# EAGLE design voedingequ (EAGLE 9.1.2)
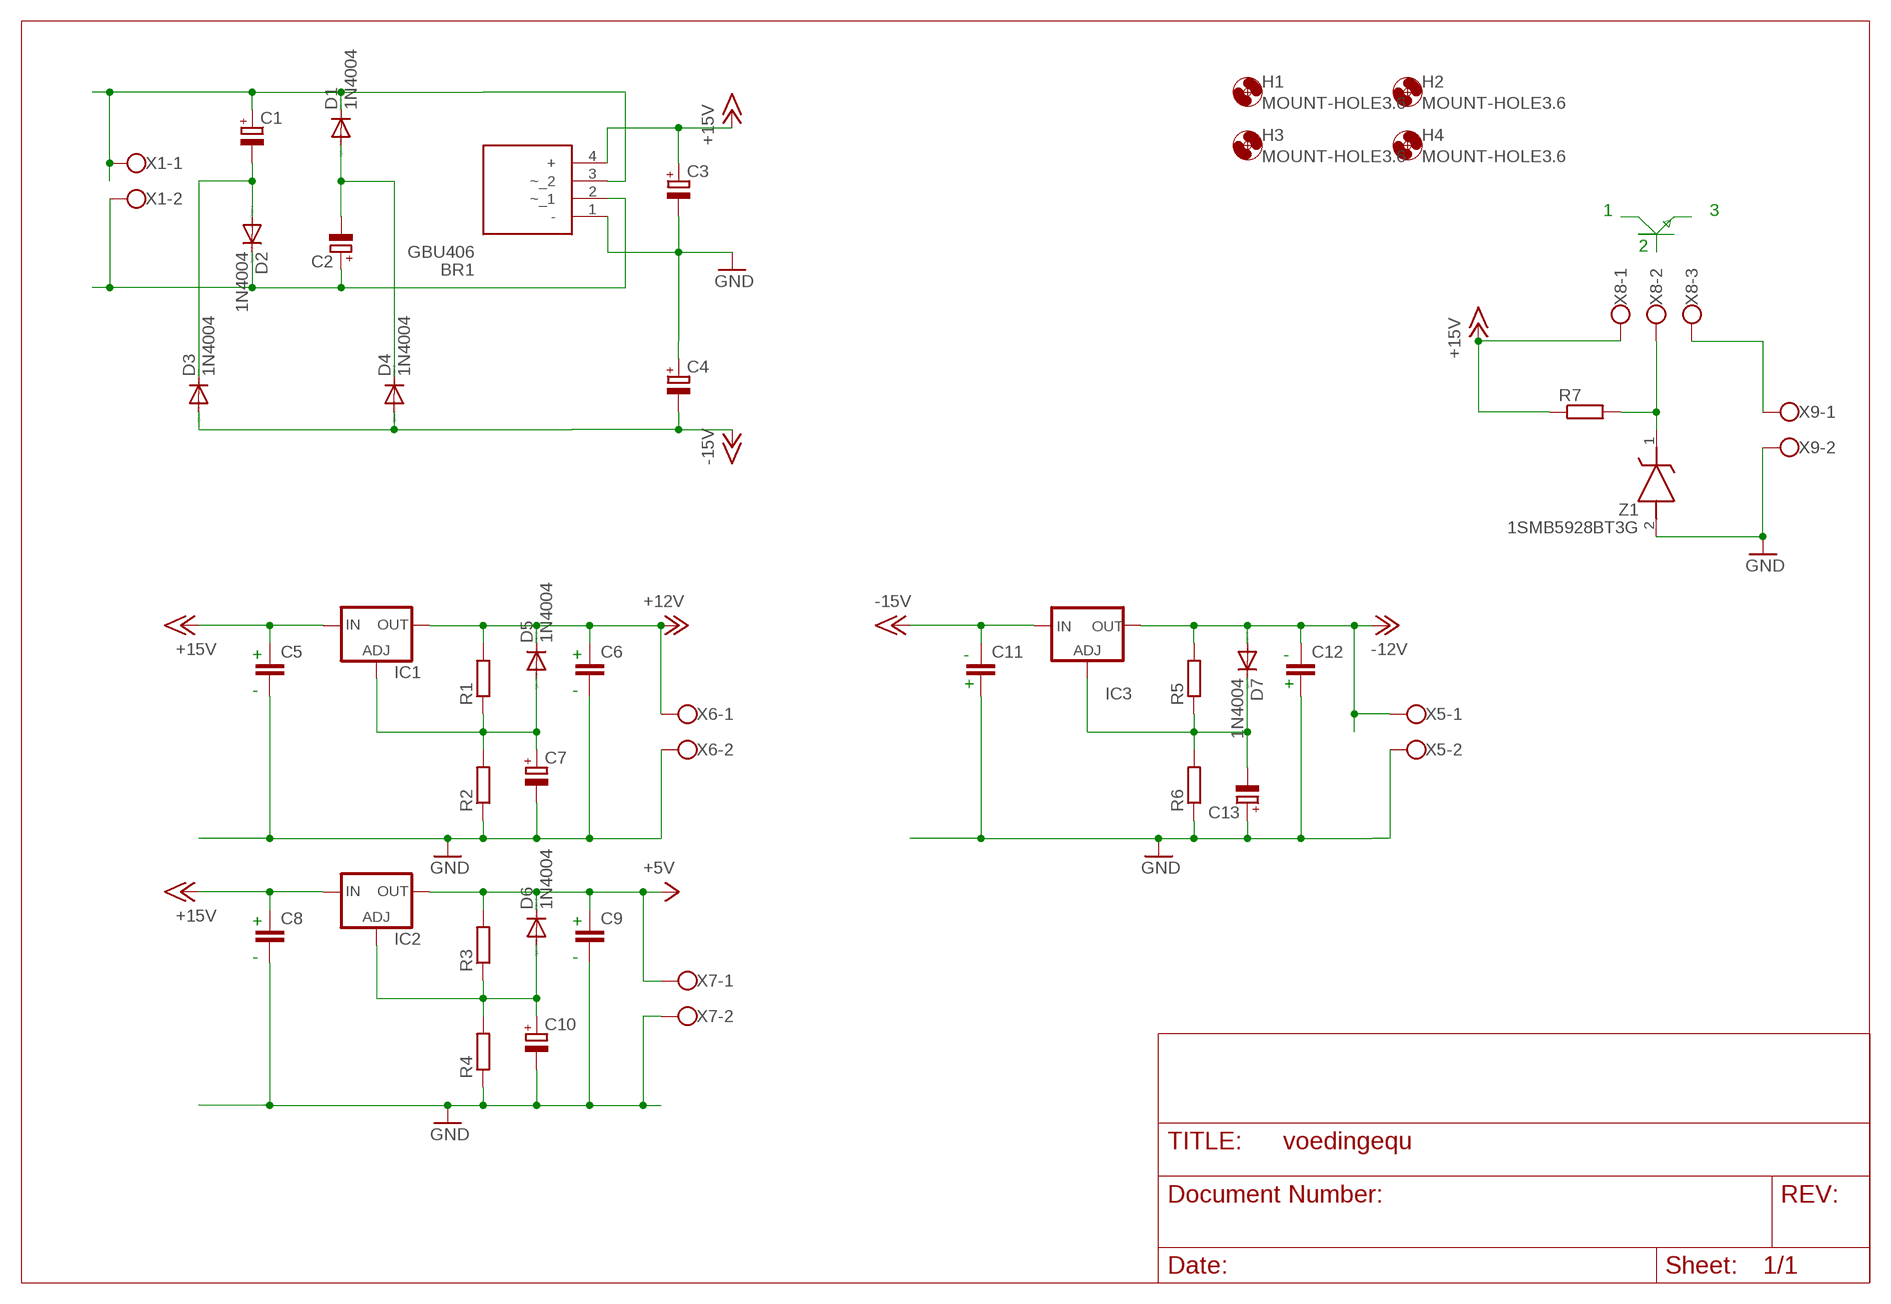
[diagram p0: schematic, sheet 1]

## Parts
BR1  GBU406  [TO508P356X2205X2135-4P]
C1  CPOL-EUE5-10.5  [E5-10,5]
C2  CPOL-EUE5-10.5  [E5-10,5]
C3  CPOL-EUE5-10.5  [E5-10,5]
C4  CPOL-EUE5-10.5  [E5-10,5]
C5  C-EUC0805  [C0805]
C6  C-EUC0805  [C0805]
C7  CPOL-EU153CLV-0505  [153CLV-0505]
C8  C-EUC0805  [C0805]
C9  C-EUC0805  [C0805]
C10  CPOL-EU153CLV-0505  [153CLV-0505]
C11  C-EUC0805  [C0805]
C12  C-EUC0805  [C0805]
C13  CPOL-EU153CLV-0505  [153CLV-0505]
D1  1N4004  [DO41-10]
D2  1N4004  [DO41-10]
D3  1N4004  [DO41-10]
D4  1N4004  [DO41-10]
D5  1N4004  [DO41-10]
D6  1N4004  [DO41-10]
D7  1N4004  [DO41-10]
H1  MOUNT-HOLE3.6  [3,6]
H2  MOUNT-HOLE3.6  [3,6]
H3  MOUNT-HOLE3.6  [3,6]
H4  MOUNT-HOLE3.6  [3,6]
IC1  LM317TS  [317TS]
IC2  LM317TS  [317TS]
IC3  LM337TS  [337TS]
R1  R-EU_R0805  [R0805]
R2  R-EU_R0805  [R0805]
R3  R-EU_R0805  [R0805]
R4  R-EU_R0805  [R0805]
R5  R-EU_R0805  [R0805]
R6  R-EU_R0805  [R0805]
R7  R-EU_R2512  [R2512]
X1  W237-102  [W237-102]
X5  W237-102  [W237-102]
X6  W237-102  [W237-102]
X7  W237-102  [W237-102]
X8  W237-103  [W237-103]
X9  W237-102  [W237-102]
Z1  1SMB5928BT3G  [DIOM5436X247N]

## Nets
+5V: C9.1 D6.C IC2.2(OUT) R3.2 X7.1
+12V: C6.1 D5.C IC1.2(OUT) R1.2 X6.1
+15V: BR1.4(+) C3.+ C5.1 C8.1 IC1.3(IN) IC2.3(IN) R7.1 X8.1
-12V: C12.1 D7.A IC3.3(OUT) R5.2 X5.1
-15V: C4.- C11.1 D3.A D4.A IC3.2(IN)
GND: BR1.1(-) C3.- C4.+ C5.2 C6.2 C7.- C8.2 C9.2 C10.- C11.2 C12.2 C13.+ R2.1 R4.1 R6.1 X5.2 X6.2 X7.2 X9.2 Z1.2(A)
N$1: C1.- D2.A D3.C
N$2: C2.- D1.A D4.C
N$3: BR1.3(~_2) C1.+ D1.C X1.1
N$4: BR1.2(~_1) C2.+ D2.C X1.2
N$5: C13.- D7.C IC3.1(ADJ) R5.1 R6.2
N$7: C7.+ D5.A IC1.1(ADJ) R1.1 R2.2
N$8: X8.3 X9.1
N$9: R7.2 X8.2 Z1.1(K)
N$11: C10.+ D6.A IC2.1(ADJ) R3.1 R4.2

## Notes on the sheet
- 1 | 3
- 2
- + | + | - | -
- + | +
- - | -
- + | +
- - | -

## Library data of the parts
BR1 = GBU406:GBU406: Diodes Inc GBU406, Bridge Rectifier, 4A 600V, 4-Pin GBU Source: Datasheet <https://www.diodes.com/assets/Datasheets/ds21225.pdf>; DESCRIPTION: Diodes Inc GBU406, Bridge Rectifier, 4A 600V, 4-Pin GBU; HEIGHT: 3.56mm; MANUFACTURER_NAME: Diodes Inc.; MANUFACTURER_PART_NUMBER: GBU406; MOUSER_PART_NUMBER: 621-GBU406; MOUSER_PRICE-STOCK: https://www.mouser.co.uk/ProductDetail/Diodes-Incorporated/GBU406/?qs=mQbszxtPdlNb%2FUCazbKsIQ%3D%3D
C1-C4 C7 C10 C13 = rcl-vito:CPOL-EU: POLARIZED CAPACITOR, European symbol
C5 C6 C8 C9 C11 C12 = rcl-vito:C-EU: CAPACITOR, European symbol
D1-D7 = diode:1N4004: DIODE general purpose rectifier, 1 A
H1-H4 = holes:MOUNT-HOLE: MOUNTING HOLE with drill center marker
IC1 IC2 = v-reg:LM317TS: VOLTAGE REGULATOR
IC3 = v-reg:LM337TS: VOLTAGE REGULATOR
R1-R7 = rcl-vito:R-EU_: RESISTOR, European symbol
X1 X5-X7 X9 = con-wago-500:W237-102: WAGO SCREW CLAMP
X8 = con-wago-500:W237-103: WAGO SCREW CLAMP
Z1 = 1SMB5928BT3G:1SMB5928BT3G: ON Semiconductor 1SMB5928BT3G Zener Diode, 13V 5% 3 W SMT 2-Pin SMB Source: Datasheet <http://www.onsemi.com/pub/Collateral/1SMB5913BT3-D.PDF>; DESCRIPTION: ON Semiconductor 1SMB5928BT3G Zener Diode, 13V 5% 3 W SMT 2-Pin SMB; HEIGHT: 2.47mm; MANUFACTURER_NAME: ON Semiconductor; MANUFACTURER_PART_NUMBER: 1SMB5928BT3G; MOUSER_PART_NUMBER: 863-1SMB5928BT3G; MOUSER_PRICE-STOCK: https://www.mouser.com/Search/Refine.aspx?Keyword=863-1SMB5928BT3G; RS_PART_NUMBER: 7925414P; RS_PRICE-STOCK: http://uk.rs-online.com/web/p/products/7925414P

## Board
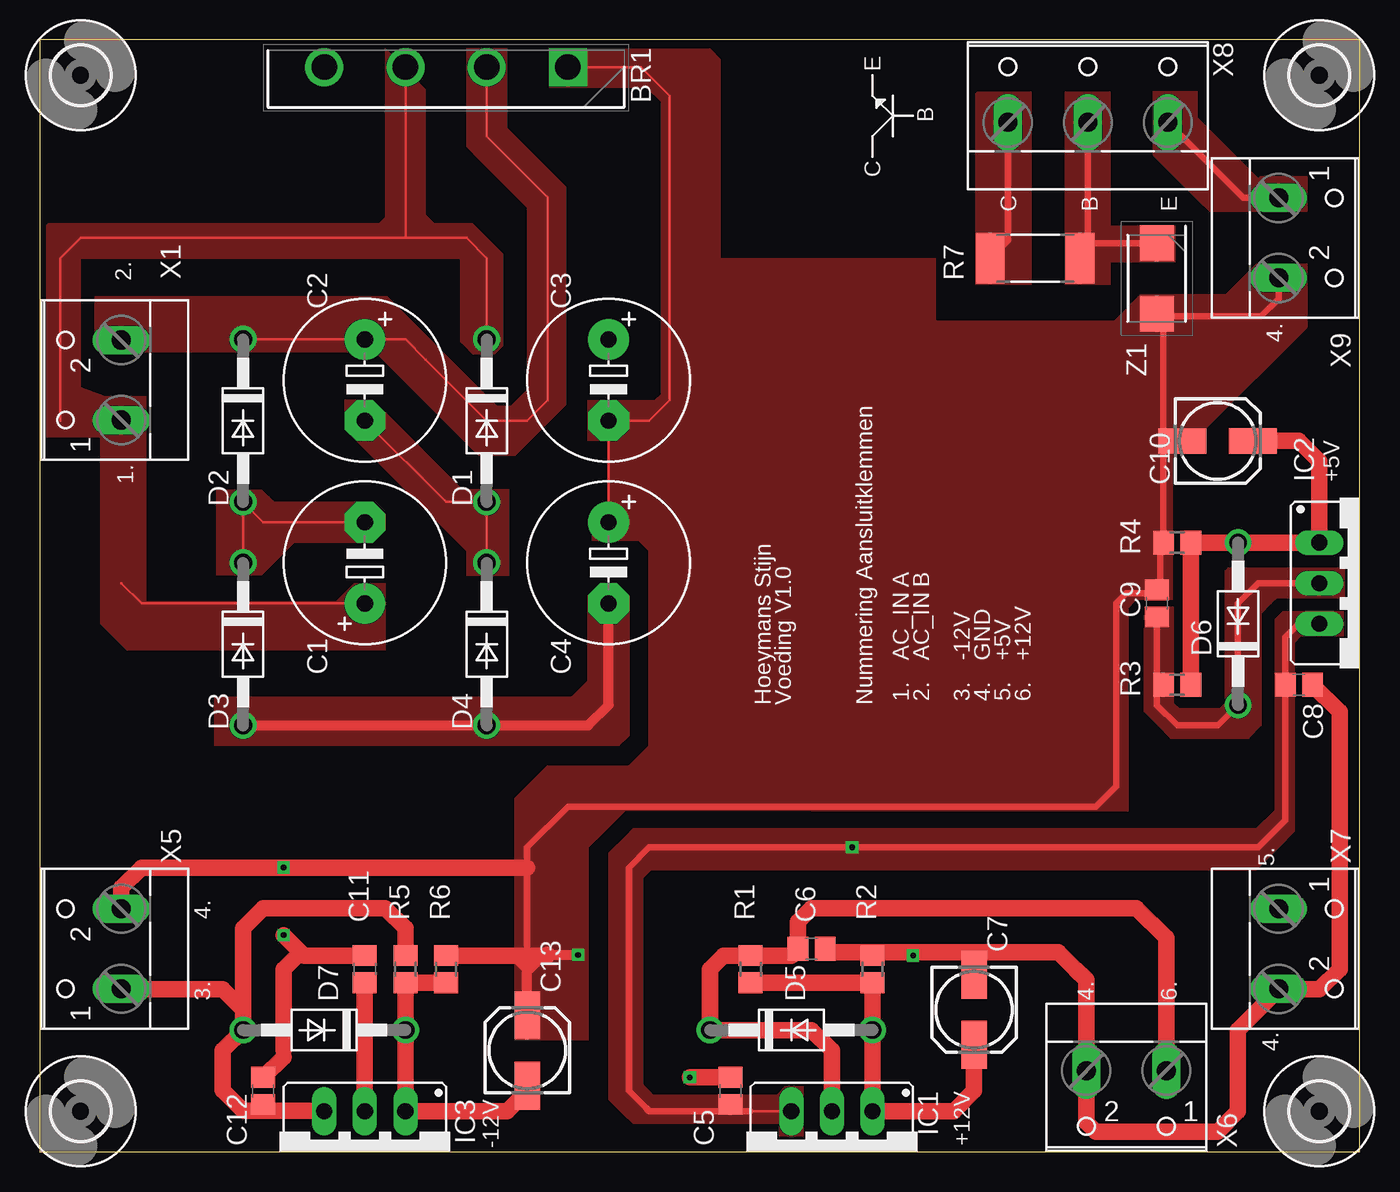
[diagram p1: board, top side]
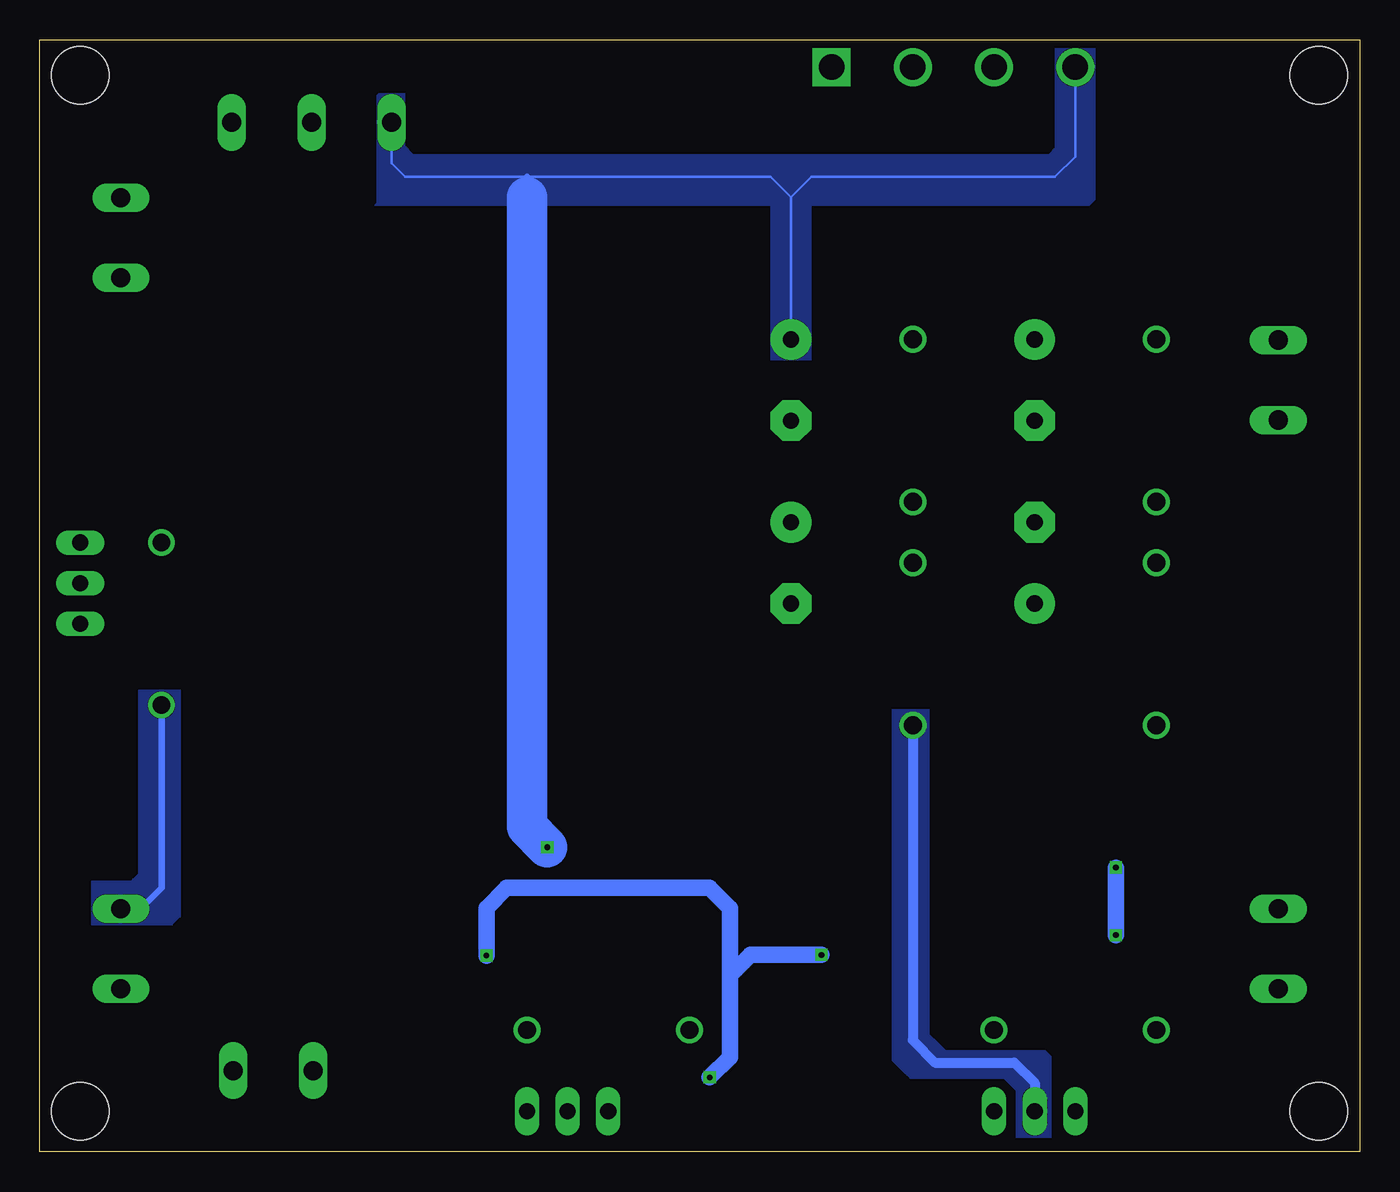
[diagram p2: board, bottom side, seen from below]

Size 82.53 x 69.52 mm. Coordinates in mm from the lower left corner, seen from the top.
Outline: 0,0 82.53,0 82.53,69.52 0,69.52 0,0
Copper layers (1*16): Top 0.035mm / dielectric 1.5mm / Bottom 0.035mm
Design rules "default *": minimum track width 6mil, minimum drill 0.35mm, track to track 6mil, track to pad 6mil, pad to pad 6mil, via to via 6mil, smd to smd 6mil, copper to edge 2mil, drill to drill 6mil, minimum pad ring 10mil, minimum via ring 8mil, stop-mask expansion 4mil, vias tented up to drill 0mil, thermal gap 1mil

### Footprints (pad centres in the part's own frame; a part is rotated, then mirrored left to right if it is on the bottom)
TO508P356X2205X2135-4P = drill 1.59 pad 2.385 square: 1 0,0 | drill 1.59 pad 2.385: 2 5.08,0; 3 10.16,0; 4 15.24,0
E5-10,5 = drill 1.016 pad 2.54: + -2.54,0 | drill 1.016 pad 2.54 octagon: - 2.54,0
C0805 = smd 1.3 x 1.5: 1 -0.85,0; 2 0.85,0
153CLV-0505 = smd 3 x 1.6: + 2.2,0; - -2.2,0
DO41-10 = drill 1.118: A 5.08,0; C -5.08,0
3,6 = hole 3.6: 0,0
317TS = drill 1.016 long: 1 -2.54,-2.54; 2 0,-2.54; 3 2.54,-2.54
337TS = drill 1.016 long: 1 -2.54,-2.54; 2 0,-2.54; 3 2.54,-2.54
R0805 = smd 1.3 x 1.5: 1 -0.85,0; 2 0.85,0
R2512 = smd 1.8 x 3.2: 1 -2.8,0; 2 2.8,0
W237-102 = drill 1.194 long: 1 -2.5,-1.27; 2 2.5,-1.27
W237-103 = drill 1.194 long: 1 -5,-1.29; 2 0,-1.29; 3 5,-1.29
DIOM5436X247N = smd 2.25 x 2.15: 1 -2.2,0; 2 2.2,0

### Placement (x,y rotation side)
BR1  33.02,67.82 180 top
C1  20.32,36.83 90 top
C2  20.32,48.26 270 top
C3  35.56,48.26 270 top
C4  35.56,36.83 270 top
C5  43.18,3.81 90 top
C6  48.26,12.7 0 top
C7  58.42,8.89 270 top
C8  78.74,29.21 0 top
C9  69.85,34.29 90 top
C10  73.66,44.45 0 top
C11  20.32,11.43 90 top
C12  13.97,3.81 90 top
C13  30.48,6.35 90 top
D1  27.94,45.72 270 top
D2  12.7,45.72 270 top
D3  12.7,31.75 270 top
D4  27.94,31.75 270 top
D5  46.99,7.62 0 top
D6  74.93,33.02 90 top
D7  17.78,7.62 180 top
H1  2.54,67.31 0 top
H2  2.54,2.54 0 top
H3  80.01,2.54 0 top
H4  80.01,67.31 0 top
IC1  49.53,0 180 top
IC2  82.55,35.56 270 top
IC3  20.32,0 180 top
R1  44.45,11.43 90 top
R2  52.07,11.43 270 top
R3  71.12,29.21 180 top
R4  71.12,38.1 0 top
R5  22.86,11.43 90 top
R6  25.4,11.43 270 top
R7  62.23,55.88 0 top
X1  3.81,48.26 90 top
X5  3.81,12.7 90 top
X6  67.94,3.81 180 top
X7  78.74,12.7 270 top
X8  65.53,65.66 0 top
X9  78.74,57.15 270 top
Z1  69.85,54.61 270 top

### Tracks (layer width: path | path; a pad name or v marks a point on that pad's centre or on a via)
+5V
  Top 0.152: R3.2 70.27,28.79
  Top 0.406: C9.1 69.85,29.63 | 69.85,29.63 R3.2 | 69.85,29.63 69.85,27.94 71.12,26.67 73.66,26.67 D6.C 74.93,34.29 76.2,35.56 IC2.2
  Bottom 0.406: D6.C 74.93,16.51 76.24,15.2 X7.1
  pour Top: 74.17,36.3 74.17,28.07 73.79,27.69 71.25,27.69 70.87,28.07 70.87,34.04 69.09,34.04 69.09,27.56 69.98,26.67 70.74,25.91 72.52,25.91 75.56,25.91 76.33,26.67 76.33,33.66 76.96,34.29 77.34,34.67 81.53,34.67 81.53,36.45 74.32,36.45
  pour Bottom: 73.79,24.77 73.79,28.83 76.33,28.83 76.33,17.4 76.71,17.02 76.83,16.89 79.25,16.89 79.25,14.22 74.3,14.22 73.79,14.73
+12V
  Top 0.406: 47.2,12.49 C6.1
  Top 1.016: C6.1 47.41,14.39 48.26,15.24 68.58,15.24 70.44,13.38 X6.1 | IC1.2 49.53,6.35 48.26,7.62 D5.C 41.91,11.43 42.76,12.28 R1.2 46.99,12.28 47.2,12.49
+15V  (via drill 0.35)
  Top 0.152: IC1.3 44.45,2.54 43.6,2.54 43.39,2.75 C5.1
  Top 0.406: IC2.3 78.74,33.02 77.89,32.17 C8.1 77.89,20.74 76.2,19.05 v50.8,19.05 38.1,19.05 36.83,17.78 36.83,3.81 37.89,2.75 38.1,2.54 39.37,2.54 44.45,2.54 43.39,2.54 43.18,2.75 | 43.18,2.75 43.39,2.75 | C5.1 43.18,2.75 | X8.1 60.53,56.98 R7.1
  Bottom 0.152: BR1.4 17.78,62.23 19.05,60.96 34.29,60.96 35.56,59.69 | 35.56,59.69 C3.+ | 35.56,59.69 36.83,60.96 52.07,60.96 59.69,60.96 60.53,61.8 X8.1
  Bottom 0.406: 52.07,59.69 52.07,60.96
  Bottom 2.54: v50.8,19.05 52.07,20.32 52.07,59.69
  pour Bottom: 16.76,68.96 19.05,68.96 19.05,62.74 19.43,62.36 59.18,62.36 59.69,62.87 59.69,66.04 59.69,66.17 61.34,66.17 61.47,66.04 61.47,59.31 61.59,59.18 16.89,59.18 16.51,59.56 16.51,68.45 16.51,68.96
  pour Top: 58.55,54.23 58.55,66.17 58.67,66.29 61.98,66.29 61.98,54.36 61.98,54.23
  pour Top: 43.18,3.56 38.35,3.56 38.1,3.81 37.72,4.19 37.72,5.21 37.72,17.14 38.23,17.65 38.38,17.65 39.24,17.65 76.07,17.65 77.47,19.05 78.49,20.07 78.49,30.86 78.49,31.88 78.87,32.26 81.41,32.26 81.53,32.26 81.53,33.78 77.72,33.78 77.22,33.27 77.22,29.59 77.22,21.34 76.07,20.19 37.08,20.19 36.7,19.81 35.56,18.67 35.56,9.78 35.56,3.3 36.45,2.41 37.08,1.78 39.62,1.78 46.23,1.78 46.23,1.02 47.75,1.02 47.75,3.94 47.75,4.06 46.61,4.06 46.23,3.68 46.1,3.56
  pour Bottom: 36.83,59.18 36.83,49.53 34.8,49.53 34.29,49.53 34.29,52.45 34.29,59.18
-12V
  Top 0.152: 14.18,2.75 C12.1
  Top 0.406: IC3.3 15.24,2.54 | 15.24,2.54 14.39,2.54 14.18,2.75 | 15.24,2.54 12.74,2.54 12.72,2.56 12.7,2.58 | 12.7,13.97 12.7,8.89 D7.A | 5.12,10.16 X5.1 | 11.43,3.85 11.45,3.83
  Top 1.016: R5.2 22.86,13.97 21.59,15.24 13.97,15.24 12.7,13.97 D7.A 11.43,6.35 11.43,3.85 12.72,2.56 17.76,2.56 IC3.3 | 12.7,8.89 11.43,10.16 5.12,10.16
-15V
  Top 0.61: D3.A D4.A 34.29,26.67 35.56,27.94 C4.-
  Top 1.016: C11.1 IC3.2
  Bottom 0.61: D4.A 27.94,6.99 26.54,5.59 21.59,5.59 20.32,4.32 IC3.2
  pour Top: 35.56,35.56 36.07,35.56 36.83,34.8 36.83,26.04 36.2,25.4 10.92,25.4 10.92,28.45 32.64,28.45 33.27,28.45 34.29,29.46 34.29,34.67 34.29,34.8 35.05,35.56
  pour Bottom: 27.94,27.69 26.92,27.69 26.92,7.37 26.42,6.86 25.91,6.35 21.84,6.35 20.07,6.35 19.68,6.35 19.3,5.97 19.3,0.89 21.34,0.89 21.46,0.89 21.46,3.81 21.59,3.94 22.23,4.57 22.99,4.57 28.07,4.57 28.57,5.08 29.21,5.71 29.21,26.67 29.21,27.69
GND  (via drill 0.35)
  Top 0.152: 49.32,12.49 C6.2 | 58.31,12.28 58.39,11.43 C7.- | 70.06,37.89 R4.1 | 30.48,11.43 30.48,10.16 | 30.48,19.05 30.48,17.78 30.48,16.51 30.48,15.24 | C4.+ C3.- 38.1,45.72 39.37,46.99 39.37,66.04 37.59,67.82 BR1.1 | C10.- 71.29,44.28 71.29,44.45 | Z1.2 70.02,52.24 | 5.1,15.22 X5.2 | 64.77,11.43 | X7.2 77.45,10.18 | 77.45,10.18 74.93,7.66 | 77.47,10.18 77.45,10.18
  Top 0.406: 15.24,5.93 15.24,6.35 | 70.06,37.89 70.06,35.35 C9.2 69.64,34.92 67.94,34.92 67.31,34.29 67.31,22.86 66.04,21.59 33.02,21.59 30.48,19.05 30.48,17.78 30.48,15.24 30.48,11.43 30.61,11.43 | R4.1 70.27,43.18 | 70.27,43.18 70.27,43.6 | 71.29,44.45 71.12,44.45 C10.- | 70.27,43.18 70.27,44.36 70.48,44.58 70.78,44.28 71.29,44.28 | 49.32,12.49 49.53,12.28 R2.1 v54.61,12.28 57.15,12.28 58.31,12.28 | 65.44,10.76 65.41,10.79 | 77.49,10.16 77.47,10.18 | X7.2 77.45,10.18 74.93,7.66 74.93,7.62 | 30.61,11.43 31.5,12.32 | X9.2 77.47,53.34 76.37,52.24 70.02,52.24 70.27,51.99 70.27,43.18 | 16.51,12.28 16.09,12.28 15.24,13.13 | 30.61,11.43
  Top 0.61: C13.+ 30.48,11.43 | 30.48,11.43 29.63,12.28 R6.1 | 30.48,11.43 30.61,11.43 31.5,12.32 31.75,12.32 v33.66,12.32
  Top 1.016: 65.44,10.76 X6.2 65.44,1.86 66.04,1.27 73.66,1.27 74.93,2.54 74.93,7.62 77.45,10.14 77.45,10.18 | 65.41,10.79 64.77,11.43 63.71,12.49 49.32,12.49 | C5.2 v40.64,4.66 | C8.2 81.28,27.52 81.28,11.43 80.01,10.16 77.49,10.16 | C12.2 15.24,5.93 | 15.24,6.35 15.24,11.43 16.09,12.28 | C11.2 16.51,12.28 v15.24,13.55 | X5.2 5.08,16.51 6.35,17.78 v15.24,17.78 30.48,17.78 | R6.1 31.71,12.28 31.75,12.32
  Bottom 0.406: 39.37,6.35 39.37,7.62 39.37,10.16 39.37,11.43 39.37,12.7 39.37,15.24
  Bottom 1.016: v15.24,13.55 v15.24,17.78 | v54.61,12.28 54.61,15.24 53.34,16.51 40.64,16.51 39.37,15.24 39.37,10.16 | 39.37,10.16 39.37,6.35 39.37,5.93 v40.64,4.66 | 39.37,11.43 38.99,11.43 38.54,11.87 | v33.66,12.32 38.1,12.32 38.54,11.87 | 38.54,11.87 39.37,11.05 39.37,10.16
  pour Top: 31.88,68.96 41.91,68.96 42.55,68.33 42.55,44.96 42.55,44.83 42.16,44.45 34.42,44.45 34.29,44.45 34.29,46.99 38.48,46.99 38.86,47.37 38.86,65.66 37.97,66.55 31.88,66.55
  pour Top: 42.16,44.45 42.55,44.83 42.55,55.88 56.01,55.88 56.01,21.34 47.12,21.34 36.58,21.34 35.18,19.94 34.29,19.05 34.29,12.7 34.29,6.99 29.97,6.99 29.72,6.99 29.72,9.27 29.72,22.1 31.75,24.13 36.83,24.13 38.1,25.4 38.1,31.75 38.1,37.59 37.47,38.23 34.54,38.23 34.54,39.37 35.56,39.37 35.56,44.32 35.56,44.45
  pour Top: 78.61,55.5 76.07,55.5 75.82,55.24 74.17,53.59 69.98,53.59 68.83,53.59 67.18,51.94 66.93,51.94 55.88,51.94 55.88,21.46 67.94,21.46 67.94,33.91 68.58,34.54 69.09,34.54 70.74,34.54 70.87,34.54 70.87,39.88 70.87,45.21 72.9,45.21 79.25,51.56 79.25,54.74 79.25,55.5
  pour Top: 48.26,22.1 48.26,21.34 68.07,21.34 68.07,33.91 67.94,34.04 55.88,34.04 55.88,23.37 48.26,23.37
N$1
  Top 0.152: D3.C D2.A 13.97,39.37 C1.-
  pour Top: 21.59,38.86 20.83,38.1 19.81,38.1 15.88,38.1 13.84,36.07 11.05,36.07 11.05,41.27 11.05,41.4 13.84,41.4 14.61,40.64 19.94,40.64 20.83,40.64 21.59,39.88 21.59,39.75
N$2
  Top 0.152: C2.- 25.4,40.64 D1.A D4.C
  pour Top: 19.05,46.23 19.05,45.21 26.67,37.59 26.67,37.21 26.67,36.32 26.67,36.07 28.96,36.07 29.08,36.07 29.34,36.07 29.34,41.27 29.34,41.4 26.42,41.4 21.46,46.35 20.83,46.99 19.05,46.99
N$3
  Top 0.152: 22.86,57.15 BR1.3 | 1.27,45.72 1.27,55.88 2.54,57.15 22.86,57.15 | 22.86,57.15 26.67,57.15 27.94,55.88 D1.C | C1.+ 6.35,34.29 5.08,35.56
  pour Top: 5.08,47.24 6.6,47.24 6.6,34.42 18.54,34.42 19.56,35.43 19.68,35.56 20.57,35.56 21.59,35.56 21.59,31.37 5.46,31.37 3.81,33.02 3.81,47.24
  pour Top: 21.59,68.96 21.59,58.42 21.21,58.04 0.51,58.04 0.38,57.91 0.38,44.7 6.6,44.7 6.6,46.27 2.54,47.77 2.54,55.88 26.29,55.88 26.29,50.67 26.54,50.42 27.05,49.91 28.32,49.91 28.45,49.91 28.96,50.42 28.96,56.13 27.18,57.91 27.05,58.04 24.89,58.04 24.77,58.04 24.64,58.04 24.13,58.55 24.13,66.42
N$4
  Top 0.152: D2.C C2.+ 22.86,50.8 24.13,49.53 25.4,48.26 27.94,45.72 30.48,45.72 31.75,46.99 31.75,59.69 27.94,63.5 BR1.2
  pour Top: 5.08,50.04 20.95,50.04 22.99,48.01 25.53,45.47 27.43,43.56 29.21,43.56 29.72,43.56 30.35,44.2 32.89,46.74 32.89,47.88 32.89,59.69 32.89,60.33 30.86,62.36 29.21,64.01 29.21,67.82 29.21,68.96 26.67,68.96 26.67,67.31 26.67,63.75 26.67,62.87 27.56,61.98 30.48,59.05 30.48,58.17 30.48,47.62 29.46,46.61 28.57,46.61 27.69,47.5 21.72,53.47 18.8,53.47 3.43,53.47 3.43,50.16 3.43,50.04
N$5
  Top 0.152: R5.1 22.86,10.16 23.28,10.58 R6.2
  Top 0.406: D7.C 22.86,10.16 R5.1 | 30.31,3.98 C13.-
  Top 1.016: R5.1 R6.2 | 30.31,3.98 30.31,3.64 29.21,2.54 IC3.1 D7.C 22.86,10.16
N$7
  Top 0.152: D5.A 52.07,10.16 | 52.07,10.16 R2.2 | R1.1 51.65,10.58 52.07,10.16
  Top 0.406: R2.2 52.07,10.16
  Top 1.016: R2.2 R1.1 | 52.07,10.16 D5.A IC1.1 57.15,2.54 58.42,3.81 C7.+
N$8
  Top 0.406: X8.3 75.25,59.65 X9.1
  pour Top: 69.6,65.66 69.6,62.36 72.52,59.44 73.15,58.8 78.74,58.8 79.25,58.8 79.25,60.58 79.25,60.96 76.33,60.96 76.2,60.83 72.39,64.64 72.39,65.91 72.39,66.29 69.6,66.29 69.6,65.79
N$9
  Top 0.152: 64.77,57.15 65.03,56.89 R7.2 65.96,56.81 Z1.1
  Top 0.406: Z1.1 65.11,56.81 65.03,56.89 | R7.2 65.53,56.38 X8.2
  pour Top: 64.14,54.36 64.14,66.29 66.8,66.29 66.93,66.29 66.93,58.04 66.93,57.91 70.87,57.91 70.99,57.91 70.99,55.63 68.71,55.63 66.93,55.63 66.93,54.36 66.93,54.23 64.14,54.23
N$11
  Top 0.152: 76.2,44.45 C10.+
  Top 1.016: 76.2,44.45 78.74,44.45 80.01,43.18 IC2.1 D6.A R4.2 R3.1

### Text on the board
tNames: E | B | C | C | B | E | 2. | 4. | 1. | +5V | A | B | AC_IN | AC_IN | -12V | GND | +5V | +12V | Hoeymans Stijn | Voeding V1.0 | Nummering Aansluitklemmen | 1. | 2. | 3. | 4. | 5. | 6. | 5. | 4. | 3. | 4. | 6. | 4. | +12V | -12V